# Altium project Stamp.PrjPcb
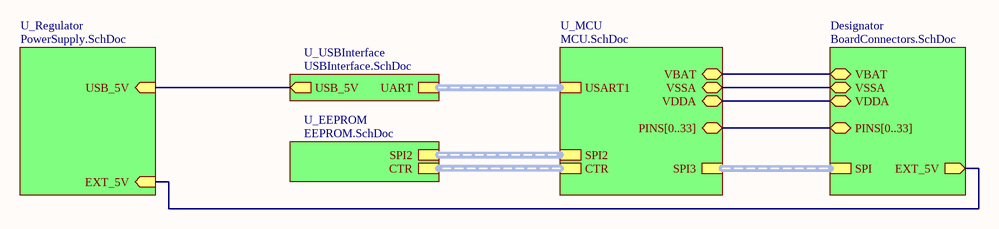
[diagram p0: Main.SchDoc]
6 sheets, 121 parts. Net scope: hierarchical (ports join the sheet entries above them; power ports are global).
Board file: Stamp.PcbDoc
Sheets:
  Main.SchDoc
    U_MCU = MCU.SchDoc
    U_USBInterface = USBInterface.SchDoc
    U_EEPROM = EEPROM.SchDoc
    U_Regulator = PowerSupply.SchDoc
    Designator = BoardConnectors.SchDoc

## Sheet Main.SchDoc
size A4; Date: 07.06.2021; Author: Mateusz Mróz; CompanyName: AGH; DocumentNumber: 1; SheetNumber: 1; SheetTotal: 6

### Sub-sheets
Designator = BoardConnectors.SchDoc: PINS[0..33] (bidir), VBAT (bidir), VDDA (bidir), VSSA (bidir), SPI (harness SPI), EXT_5V (out)
U_EEPROM = EEPROM.SchDoc: SPI2 (harness SPI), CTR (harness CTR)
U_MCU = MCU.SchDoc: CTR (harness CTR), PINS[0..33] (bidir), VDDA (bidir), VBAT (bidir), VSSA (bidir), USART1 (harness USART), SPI2 (harness SPI), SPI3 (harness SPI)
U_Regulator = PowerSupply.SchDoc: EXT_5V (in), USB_5V (in)
U_USBInterface = USBInterface.SchDoc: UART (harness UART), USB_5V (out)

### Nets
EXT_5V: sheet U_Regulator/EXT_5V, sheet Designator/EXT_5V
USB_5V: sheet U_USBInterface/USB_5V, sheet U_Regulator/USB_5V
VBAT_PIN: sheet U_MCU/VBAT, sheet Designator/VBAT
VDDA_PIN: sheet U_MCU/VDDA, sheet Designator/VDDA
VSAA_PIN: sheet U_MCU/VSSA, sheet Designator/VSSA

### Buses and harness runs
bus sheet Designator/PINS[0..33] = sheet U_MCU/PINS[0..33]
harness sheet Designator/SPI = sheet U_MCU/SPI3
harness sheet U_EEPROM/CTR = sheet U_MCU/CTR
harness sheet U_EEPROM/SPI2 = sheet U_MCU/SPI2
harness sheet U_MCU/USART1 = sheet U_USBInterface/UART

### Notes on the sheet
- University name:
- Degree course:
- 3th year electronics
- Date:
- Author:
- Student Index:
- Course:
- Checked by:
- PUE
- dr hab. inż. Cezary Worek, prof. AGH
- 305093
- Project name:
- Document name:
- Variant name:
- Sheet/all:
- /
- Version number:

## Sheet MCU.SchDoc
size A4; Date: 07.06.2021; Author: Mateusz Mróz; CompanyName: AGH; DocumentNumber: 2; SheetNumber: 2; SheetTotal: 6
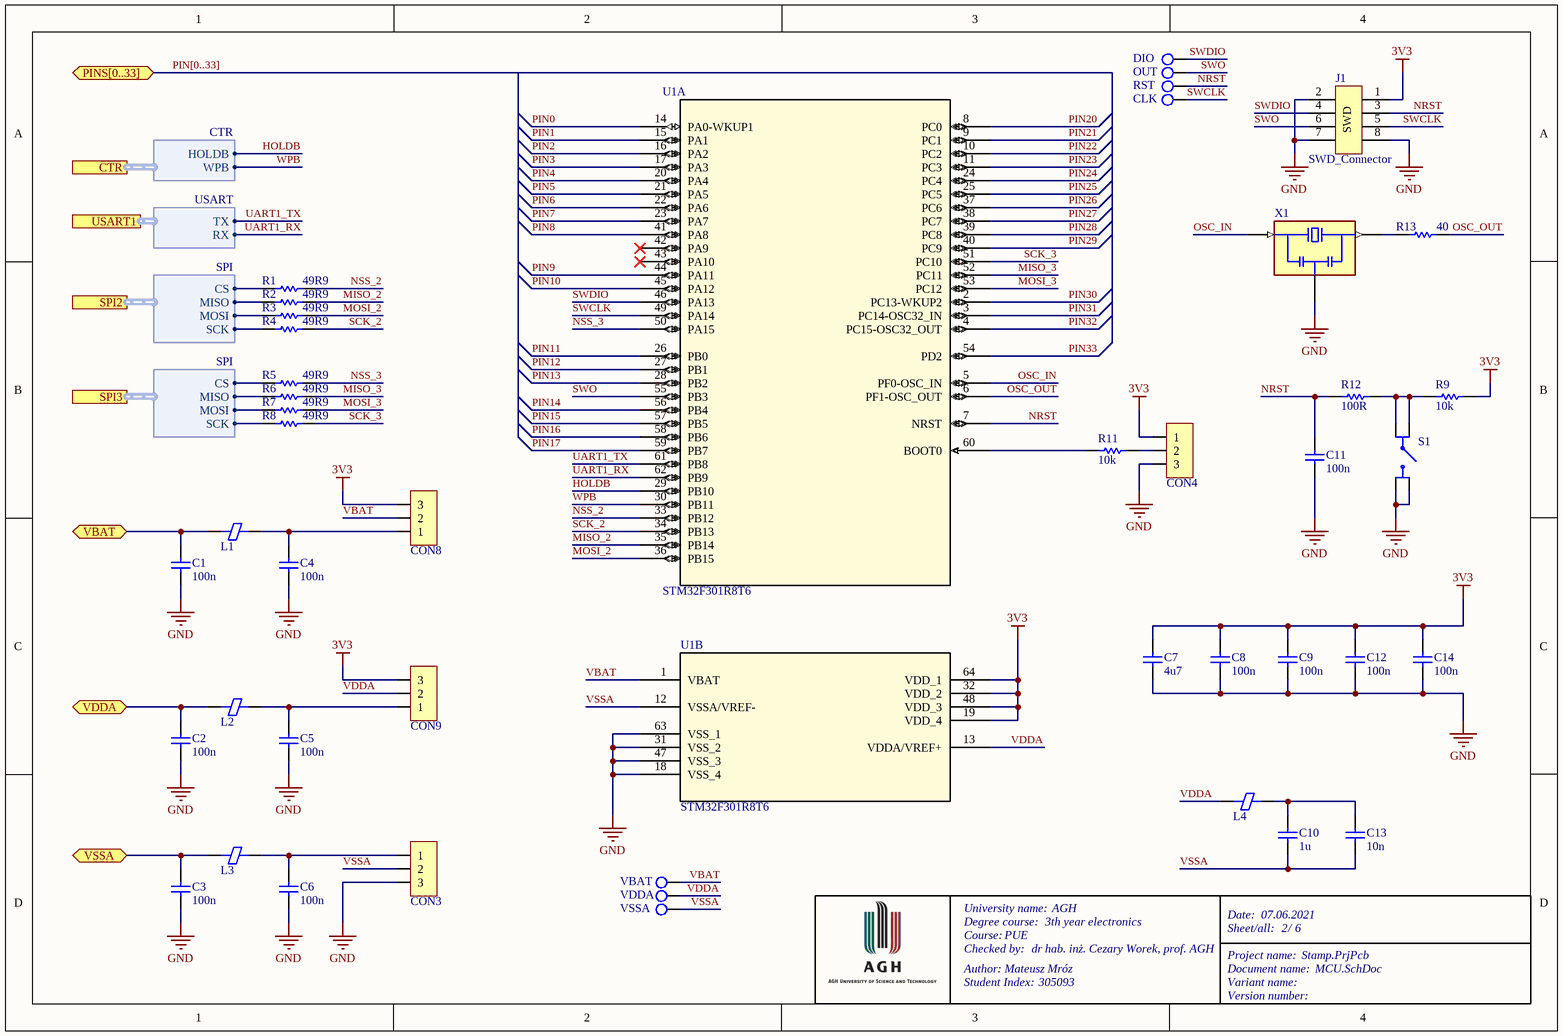
[diagram p1: MCU.SchDoc]

### Parts
C1  100n  [Cap_0402_MD_outline]
C2  100n  [Cap_0402_MD_outline]
C3  100n  [Cap_0402_MD_outline]
C4  100n  [Cap_0402_MD_outline]
C5  100n  [Cap_0402_MD_outline]
C6  100n  [Cap_0402_MD_outline]
C7  4u7  [Cap_0805_MD_outline]
C8  100n  [Cap_0603_MD_outline]
C9  100n  [Cap_0603_MD_outline]
C10  1u  [Cap_0805_MD_outline]
C11  100n  [Cap_0603_MD_outline]
C12  100n  [Cap_0603_MD_outline]
C13  10n  [Cap_0603_MD_outline]
C14  100n  [Cap_0603_MD_outline]
CON3  Header 3  [HDR_1X3_2.54]  (value not drawn)
CON4  Header 3  [HDR_1X3_2.54]  (value not drawn)
CON8  Header 3  [HDR_1X3_2.54]  (value not drawn)
CON9  Header 3  [HDR_1X3_2.54]  (value not drawn)
J1  SWD_Connector  [MicroLock_6p_vert]
L1  (no value)  [Bead_0402_MD]
L2  (no value)  [Bead_0402_MD]
L3  (no value)  [Bead_0402_MD]
L4  (no value)  [Bead_0402_MD]
R1  49R9  [Res_0603_MD_outline]
R2  49R9  [Res_0603_MD_outline]
R3  49R9  [Res_0603_MD_outline]
R4  49R9  [Res_0603_MD_outline]
R5  49R9  [Res_0603_MD]
R6  49R9  [Res_0603_MD]
R7  49R9  [Res_0603_MD]
R8  49R9  [Res_0603_MD]
R9  10k  [Res_0603_MD_outline]
R11  10k  [Res_0603_MD_outline]
R12  100R  [Res_0603_MD_outline]
R13  40  [Res_0603_MD_outline]
S1  Switch  [EVPBB0AAB000]  (value not drawn)
TP1  VBAT  [TP_SQ40]  (no BOM)
TP2  VDDA  [TP_SQ40]  (no BOM)
TP3  VSSA  [TP_SQ40]  (no BOM)
TP4  DIO  [TP_SQ25x40]  (no BOM)
TP5  OUT  [TP_SQ25x40]  (no BOM)
TP6  RST  [TP_SQ25x40]  (no BOM)
TP7  CLK  [TP_SQ25x40]  (no BOM)
U1  STM32F301R8T6  [LQFP64-10x10mm]  (parts A,B of 2)
X1  Resonator  [OSC_CSTNE8M00GH5L000R0]  (value not drawn)

### Ports
CTR (harness CTR), PINS[0..33] (bidir), SPI2 (harness SPI), SPI3 (harness SPI), USART1 (harness USART), VBAT (bidir), VDDA (bidir), VSSA (bidir)

### Harnesses
USART: TX, RX
SPI: CS, MISO, MOSI, SCK
CTR: HOLDB, WPB

### Nets
3V3: C7.2 C8.2 C9.2 C12.2 C14.2 CON4.1 CON8.3 CON9.3 J1.1 R9.2 U1.19(VDD_4) U1.32(VDD_2) U1.48(VDD_3) U1.64(VDD_1)
GND: C1.2 C2.2 C3.2 C4.2 C5.2 C6.2 C7.1 C8.1 C9.1 C11.1 C12.1 C14.1 CON3.3 CON4.3 J1.2 J1.7 J1.8 S1.A1(NO_1) S1.A2(NO_2) U1.18(VSS_4) U1.31(VSS_2) U1.47(VSS_3) U1.63(VSS_1) X1.2(GND)
CS: R1.1 ; port SPI2.CS
HOLDB: U1.29(PB10) ; port CTR.HOLDB
MISO: R2.1 ; port SPI2.MISO
MISO_2: R2.2 U1.35(PB14)
MISO_3: R6.2 U1.52(PC11)
MISO_PIN: R6.1 ; port SPI3.MISO
MOSI: R3.1 ; port SPI2.MOSI
MOSI_2: R3.2 U1.36(PB15)
MOSI_3: R7.2 U1.53(PC12)
MOSI_PIN: R7.1 ; port SPI3.MOSI
NRST: C11.2 J1.3 R12.2 TP6.1 U1.7(NRST)
NSS_2: R1.2 U1.33(PB12)
NSS_3: R5.2 U1.50(PA15)
NSS_PIN: R5.1 ; port SPI3.CS
OSC_IN: U1.5(PF0-OSC_IN) X1.1(IN)
OSC_OUT: R13.2 U1.6(PF1-OSC_OUT)
PIN0: U1.14(PA0-WKUP1)
PIN1: U1.15(PA1)
PIN2: U1.16(PA2)
PIN3: U1.17(PA3)
PIN4: U1.20(PA4)
PIN5: U1.21(PA5)
PIN6: U1.22(PA6)
PIN7: U1.23(PA7)
PIN8: U1.41(PA8)
PIN9: U1.44(PA11)
PIN10: U1.45(PA12)
PIN11: U1.26(PB0)
PIN12: U1.27(PB1)
PIN13: U1.28(PB2)
PIN14: U1.56(PB4)
PIN15: U1.57(PB5)
PIN16: U1.58(PB6)
PIN17: U1.59(PB7)
PIN20: U1.8(PC0)
PIN21: U1.9(PC1)
PIN22: U1.10(PC2)
PIN23: U1.11(PC3)
PIN24: U1.24(PC4)
PIN25: U1.25(PC5)
PIN26: U1.37(PC6)
PIN27: U1.38(PC7)
PIN28: U1.39(PC8)
PIN29: U1.40(PC9)
PIN30: U1.2(PC13-WKUP2)
PIN31: U1.3(PC14-OSC32_IN)
PIN32: U1.4(PC15-OSC32_OUT)
PIN33: U1.54(PD2)
SCK: R4.1 ; port SPI2.SCK
SCK_2: R4.2 U1.34(PB13)
SCK_3: R8.2 U1.51(PC10)
SCK_PIN: R8.1 ; port SPI3.SCK
SWCLK: J1.5 TP7.1 U1.49(PA14)
SWDIO: J1.4 TP4.1 U1.46(PA13)
SWO: J1.6 TP5.1 U1.55(PB3)
UART1_RX: U1.62(PB9) ; port USART1.RX
UART1_TX: U1.61(PB8) ; port USART1.TX
VBAT: CON8.2 TP1.1 U1.1(VBAT)
VBAT_PIN: C1.1 L1.1 ; port VBAT
VDDA: CON9.2 L4.1 TP2.1 U1.13(VDDA/VREF+)
VDDA_PIN: C2.1 L2.1 ; port VDDA
VSAA_PIN: C3.1 L3.1 ; port VSSA
VSSA: C10.1 C13.1 CON3.2 TP3.1 U1.12(VSSA/VREF-)
WPB: U1.30(PB11) ; port CTR.WPB
NetC4_1: C4.1 CON8.1 L1.2
NetC5_1: C5.1 CON9.1 L2.2
NetC6_1: C6.1 CON3.1 L3.2
NetC10_2: C10.2 C13.2 L4.2
NetCON4_2: CON4.2 R11.1
NetR9_1: R9.1 R12.1 S1.B1(COM_1) S1.B2(COM_2)
NetR11_2: R11.2 U1.60(BOOT0)
NetR13_1: R13.1 X1.3(OUT)

Not connected (* = marked no-connect by the designer): U1 42(PA9)* 43(PA10)*

### Buses and harness runs
bus PIN[0..33] = port PINS[0..33]

### Notes on the sheet
- University name:
- Degree course:
- 3th year electronics
- Date:
- Author:
- Student Index:
- Course:
- Checked by:
- PUE
- dr hab. inż. Cezary Worek, prof. AGH
- 305093
- Project name:
- Document name:
- Variant name:
- Sheet/all:
- /
- Version number:
- (in symbol SWD_Connector) SWD

### Library data of the parts
C1-C6 = Capacitor: MPN: GRM155R71H103MA88; Value: 100n; Package: 0402
C7 = Capacitor: MPN: GRM21BR71C475ME51; Value: 4u7; Package: 0805
C8 C9 C11 C12 C14 = Capacitor: MPN: GRM188R72A104KA35; Value: 100n; Package: 0603
C10 = Capacitor: MPN: GRM219R7YA105KA12; Value: 1u; Package: 0805
C13 = Capacitor: MPN: GRM188R72A103KA01; Value: 10n; Package: 0603
CON3 CON4 CON8 CON9 = Header 3: Header, 3-Pin; MPN: G800LR305018EU
J1 = SWD_Connector: Connector; MPN: 5055680671
L1-L4 = Bead: Ferrite bead; MPN: BLM15PX601SN1; Package: 0402
R1-R8 = Resistor: MPN: CRCW060349R9FKEA; Value: 49R9; Package: 0603
R9 R11 = Resistor: MPN: CRCW060310K0FKEAC; Value: 10k; Package: 0603
R12 = Resistor: MPN: CRCW0603100RFKEAHP; Value: 100R; Package: 0603
R13 = Resistor: MPN: CRCW060340R2FKEA; Value: 40; Package: 0603
S1 = EVP-BB0AAB000: MPN: EVP-BB0AAB000
TP1-TP7 = TestPoint: Test point; HelpURL: *; MPN: *
  TP1: Value: VBAT
  TP2: Value: VDDA
  TP3: Value: VSSA
  TP4: Value: DIO
  TP5: Value: OUT
  TP6: Value: RST
  TP7: Value: CLK
U1 = STM32F301R8T6: MCU LQFP64; Vendor: STMicroelectronics; Built_By: EMA_UL_Team; SourceLibrary: Updates_to_database_2020-10-19; Copyright: Copyright (C) 2018 Accelerated Designs. All rights reserved; RefDes: RefDes; Type: DEV; MPN: STM32F301R8T6
X1 = CSTNE8M00GH5L000R0_1: 8MHz Ceramic Resonator; MF: Murata Electronics; Value: 8MHz; MPN: CSTNE8M00GH5L000R0

## Sheet USBInterface.SchDoc
size A4; Date: 07.06.2021; Author: Mateusz Mróz; CompanyName: AGH; DocumentNumber: 3; SheetNumber: 3; SheetTotal: 6
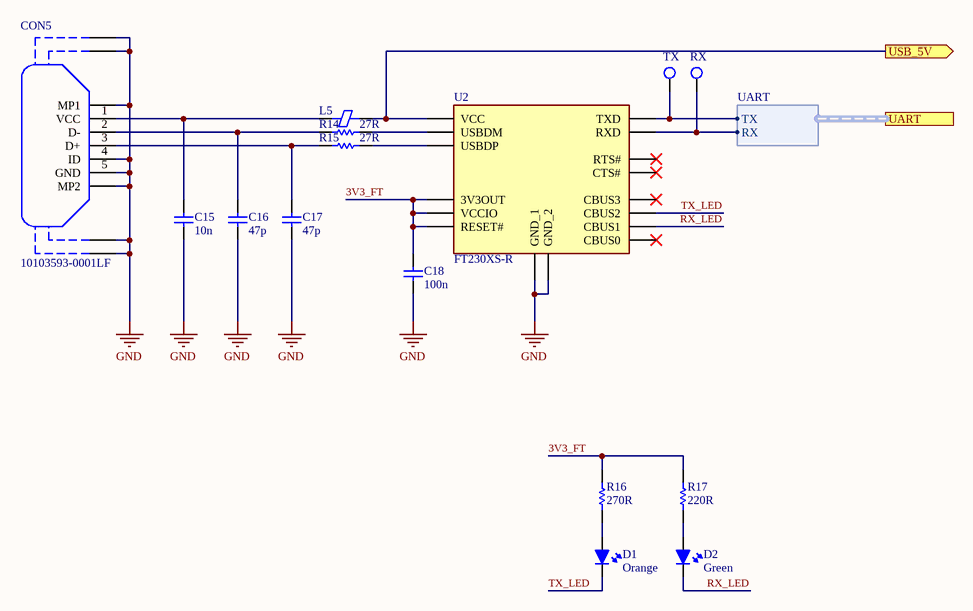
[diagram p2: USBInterface.SchDoc]

### Parts
C15  10n  [Cap_0603_MD_outline]
C16  47p  [Cap_0402_MD_outline]
C17  47p  [Cap_0402_MD_outline]
C18  100n  [Cap_0603_MD_outline]
CON5  10103593-0001LF  [101035930001LF]
D1  Orange  [LED_0805_OUTLINE]
D2  Green  [LED_0805_OUTLINE]
L5  (no value)  [Bead_0805_MD_outline]
R14  27R  [Res_0603_MD_outline]
R15  27R  [Res_0603_MD_outline]
R16  270R  [Res_0805_MD_outline]
R17  220R  [Res_0805_MD_outline]
TP8  TX  [TP_SQ25x40]  (no BOM)
TP9  RX  [TP_SQ25x40]  (no BOM)
U2  FT230XS-R  [SOP64P599X175-16N]

### Ports
UART (harness UART), USB_5V (out)

### Harnesses
UART: TX, RX

### Nets
GND: C15.1 C16.1 C17.1 C18.1 CON5.4(ID) CON5.5(GND) CON5.MH1 CON5.MH2 CON5.MH3 CON5.MH4 CON5.MP1 CON5.MP2 U2.5(GND_1) U2.13(GND_2)
3V3_FT: C18.2 R16.2 R17.2 U2.3(VCCIO) U2.10(3V3OUT) U2.11(RESET#)
RX_LED: D2.K U2.14(CBUS1)
TX_LED: D1.K U2.7(CBUS2)
UART1_RX: TP9.1 U2.4(RXD) ; port UART.RX
UART1_TX: TP8.1 U2.1(TXD) ; port UART.TX
USB_5V: L5.2 U2.12(VCC) ; port USB_5V
NetC15_2: C15.2 CON5.1(VCC) L5.1
NetC16_2: C16.2 CON5.2(D-) R14.1
NetC17_2: C17.2 CON5.3(D+) R15.1
NetD1_A: D1.A R16.1
NetD2_A: D2.A R17.1
NetR14_2: R14.2 U2.9(USBDM)
NetR15_2: R15.2 U2.8(USBDP)

Not connected (* = marked no-connect by the designer): U2 2(RTS#)* 6(CTS#)* 15(CBUS0)* 16(CBUS3)*

### Notes on the sheet
- University name:
- Degree course:
- 3th year electronics
- Date:
- Author:
- Student Index:
- Course:
- Checked by:
- PUE
- dr hab. inż. Cezary Worek, prof. AGH
- 305093
- Project name:
- Document name:
- Variant name:
- Sheet/all:
- /
- Version number:

### Library data of the parts
C15 = Capacitor: MPN: GRM188R72A103KA01; Value: 10n; Package: 0603
C16 C17 = Capacitor: MPN: VJ0402A470JXXCW1BC; Value: 47p; Package: 0402
C18 = Capacitor: MPN: GRM188R72A104KA35; Value: 100n; Package: 0603
CON5 = 10103593-0001LF: USB Connector; Manufacturer_Name: Amphenol; Datasheet Link: https://4donline.ihs.com/images/VipMasterIC/IC/FRCI/FRCIS73238/FRCIS73238-1.pdf?hkey=6D3A4C79FDBF58556ACFDE234799DDF0; Height: 3.24mm; MPN: 10103593-0001LF; Mouser Part Number: 649-10103593-0001LF; Mouser Price/Stock: https://www.mouser.co.uk/ProductDetail/Amphenol-FCI/10103593-0001LF/?qs=EnLMdcWnKAAYkpXwqGEfpw%3D%3D
D1 = LED: MPN: 599-0130-007F; Colour: Orange
D2 = LED: MPN: 599-0181-007F; Colour: Green
L5 = Bead: Ferrite bead; MPN: MPZ2012S601AT000
R14 R15 = Resistor: MPN: MCT06030C2709FP500; Value: 27R; Package: 0603
R16 = Resistor: MPN: RCS0805270RFKEA; Value: 270R; Package: 0805
R17 = Resistor: MPN: RCS0805220RFKEA; Value: 220R; Package: 0805
TP8 TP9 = TestPoint: Test point; HelpURL: *; MPN: *
  TP8: Value: TX
  TP9: Value: RX
U2 = FT230XS-R: USB converter; Manufacturer_Name: FTDI Chip; Datasheet Link: http://www.ftdichip.com/Support/Documents/DataSheets/ICs/DS_FT230X.pdf; Height: 1.753mm; MPN: FT230XS-R; Mouser Part Number: 895-FT230XS-R; Mouser Price/Stock: https://www.mouser.co.uk/ProductDetail/FTDI/FT230XS-R?qs=Gp1Yz1mis3XyCLeYOseSng%3D%3D; Arrow Part Number: FT230XS-R; Arrow Price/Stock: http://www.arrow.com/en/products/ft230xs-r/ftdi-chip

## Sheet EEPROM.SchDoc
size A4; Date: 07.06.2021; Author: Mateusz Mróz; CompanyName: AGH; DocumentNumber: 4; SheetNumber: 4; SheetTotal: 6
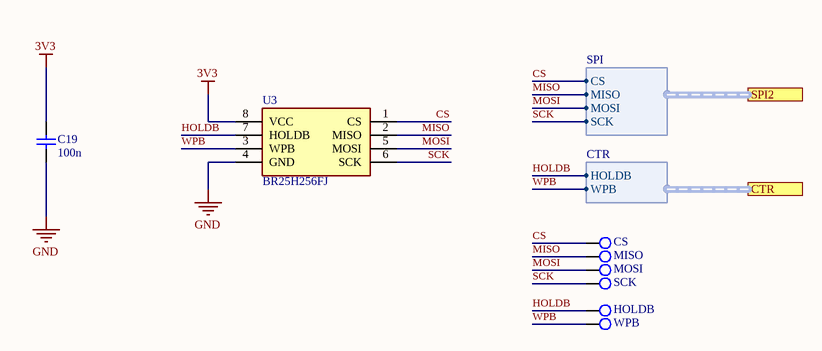
[diagram p3: EEPROM.SchDoc]

### Parts
C19  100n  [Cap_0603_MD_outline]
TP10  CS  [TP_SQ25x40]  (no BOM)
TP11  MISO  [TP_SQ25x40]  (no BOM)
TP12  MOSI  [TP_SQ25x40]  (no BOM)
TP13  SCK  [TP_SQ25x40]  (no BOM)
TP14  HOLDB  [TP_SQ25x40]  (no BOM)
TP15  WPB  [TP_SQ25x40]  (no BOM)
U3  BR25H256FJ  [SOIC127P600X165-8N]

### Ports
CTR (harness CTR), SPI2 (harness SPI)

### Harnesses
SPI: CS, MISO, MOSI, SCK
CTR: HOLDB, WPB

### Nets
3V3: C19.2 U3.8(VCC)
GND: C19.1 U3.4(GND)
CS: TP10.1 U3.1(CS) ; port SPI2.CS
HOLDB: TP14.1 U3.7(HOLDB) ; port CTR.HOLDB
MISO: TP11.1 U3.2(MISO) ; port SPI2.MISO
MOSI: TP12.1 U3.5(MOSI) ; port SPI2.MOSI
SCK: TP13.1 U3.6(SCK) ; port SPI2.SCK
WPB: TP15.1 U3.3(WPB) ; port CTR.WPB

### Notes on the sheet
- University name:
- Degree course:
- 3th year electronics
- Date:
- Author:
- Student Index:
- Course:
- Checked by:
- PUE
- dr hab. inż. Cezary Worek, prof. AGH
- 305093
- Project name:
- Document name:
- Variant name:
- Sheet/all:
- /
- Version number:

### Library data of the parts
C19 = Capacitor: MPN: GRM188R72A104KA35; Value: 100n; Package: 0603
TP10-TP15 = TestPoint: Test point; HelpURL: *; MPN: *
  TP10: Value: CS
  TP11: Value: MISO
  TP12: Value: MOSI
  TP13: Value: SCK
  TP14: Value: HOLDB
  TP15: Value: WPB
U3 = BR25H256FJ: EEPROM; Manufacturer_Name: ROHM Semiconductor; MPN: BR25H256FJ-2ACE2; Datasheet Link: https://ms.componentsearchengine.com/Datasheets/1/BR25H256FJ-2ACE2.pdf; Height: 1.65mm; Mouser Part Number: 755-BR25H256FJ-2ACE2; Mouser Price/Stock: https://www.mouser.co.uk/ProductDetail/ROHM-Semiconductor/BR25H256FJ-2ACE2?qs=zGux8KhMp6KpbA8DPfpjPg%3D%3D

## Sheet PowerSupply.SchDoc
size A4; Date: 07.06.2021; Author: Mateusz Mróz; CompanyName: AGH; DocumentNumber: 5; SheetNumber: 5; SheetTotal: 6
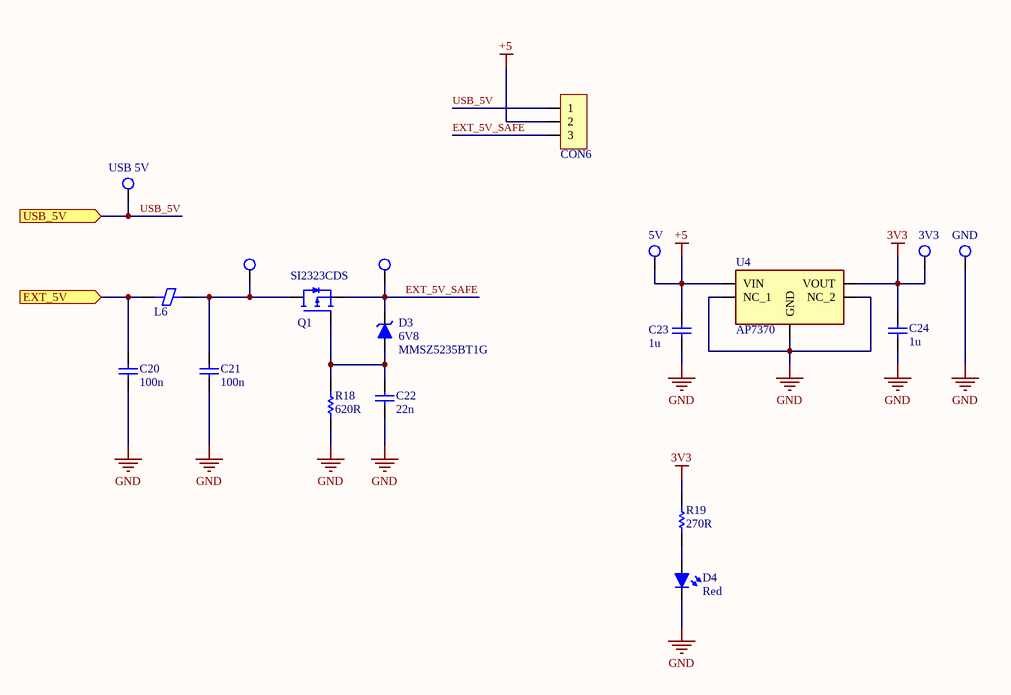
[diagram p4: PowerSupply.SchDoc]

### Parts
C20  100n  [Cap_0402_MD_outline]
C21  100n  [Cap_0402_MD_outline]
C22  22n  [Cap_0603_MD_outline]
C23  1u  [Cap_0805_MD_outline]
C24  1u  [Cap_0805_MD_outline]
CON6  Header 3  [HDR_1X3_2.54]  (value not drawn)
D3  MMSZ5235BT1G  Zener volatge: 6V8  [SOD3716X135N]
D4  Red  [LED_0805_OUTLINE]
L6  (no value)  [Bead_0402_MD_Outline]
Q1  SI2323CDS  [SOT95P237X112-3N]
R18  620R  [Res_0603_MD_outline]
R19  270R  [Res_0805_MD_outline]
TP16  USB 5V  [TP_SQ40]  (no BOM)
TP17  *  [TP_SQ40]  (value not drawn)  (no BOM)
TP18  *  [TP_SQ40]  (value not drawn)  (no BOM)
TP19  5V  [TP_SQ40]  (no BOM)
TP20  3V3  [TP_SQ40]  (no BOM)
TP21  GND  [TP_SQ40]  (no BOM)
U4  AP7370  [SOT95P285X140-5N]

### Ports
EXT_5V (in), USB_5V (in)

### Nets
3V3: C24.2 R19.2 TP20.1 U4.3(VOUT)
+5: C23.2 CON6.2 TP19.1 U4.1(VIN)
GND: C20.2 C21.1 C22.1 C23.1 C24.1 D4.K R18.1 TP21.1 U4.2(GND) U4.4(NC_1) U4.5(NC_2)
EXT_5V: C20.1 L6.1 ; port EXT_5V
EXT_5V_SAFE: CON6.3 D3.1(K) Q1.2(S) TP18.1
USB_5V: CON6.1 TP16.1 ; port USB_5V
NetC21_2: C21.2 L6.2 Q1.3(D) TP17.1
NetC22_2: C22.2 D3.2(A) Q1.1(G) R18.2
NetD4_A: D4.A R19.1

### Notes on the sheet
- University name:
- Degree course:
- 3th year electronics
- Date:
- Author:
- Student Index:
- Course:
- Checked by:
- PUE
- dr hab. inż. Cezary Worek, prof. AGH
- 305093
- Project name:
- Document name:
- Variant name:
- Sheet/all:
- /
- Version number:

### Library data of the parts
C20 C21 = Capacitor: MPN: GRM155R71H103MA88; Value: 100n; Package: 0402
C22 = Capacitor: MPN: GRM188R72A223KAC4D; Value: 22n; Package: 0603
C23 C24 = Capacitor: MPN: GRM219R7YA105KA12; Value: 1u; Package: 0805
CON6 = Header 3: Header, 3-Pin; MPN: G800LR305018EU
D3 = MMSZ5240BT1G: Zener Diode; MPN: MMSZ5235BT1G
D4 = LED: MPN: 599-0110-007F; Colour: Red
L6 = Bead: Ferrite bead; MPN: BLM15PX601SN1; Package: 0402
Q1 = SI2323CDS: P-MOSFET; MPN: SI2323CDS-T1-GE3
R18 = Resistor: MPN: CRCW0603620RFKEAC; Value: 620R; Package: 0603
R19 = Resistor: MPN: RCS0805270RFKEA; Value: 270R; Package: 0805
TP16-TP21 = TestPoint: Test point; HelpURL: *; MPN: *
  TP16: Value: USB 5V
  TP17 TP18: Value: *
  TP19: Value: 5V
  TP20: Value: 3V3
  TP21: Value: GND
U4 = AP7370-33WW-7: Volatge Regulator 3V3; Manufacturer_Name: Diodes Inc.; Datasheet Link: https://componentsearchengine.com/Datasheets/1/AP7370-33WW-7.pdf; Height: 1.4mm; Mouser Part Number: 621-AP7370-33WW-7; Mouser Price/Stock: https://www.mouser.co.uk/ProductDetail/Diodes-Incorporated/AP7370-33WW-7?qs=%252B6g0mu59x7LthBU4%252B8t%252BZQ%3D%3D; Arrow Part Number: AP7370-33WW-7; Arrow Price/Stock: https://www.arrow.com/en/products/ap7370-33ww-7/diodes-incorporated; MPN: AP7370-33WW-7

## Sheet BoardConnectors.SchDoc
size A4; Date: 07.06.2021; Author: Mateusz Mróz; CompanyName: AGH; DocumentNumber: 6; SheetNumber: 6; SheetTotal: 6
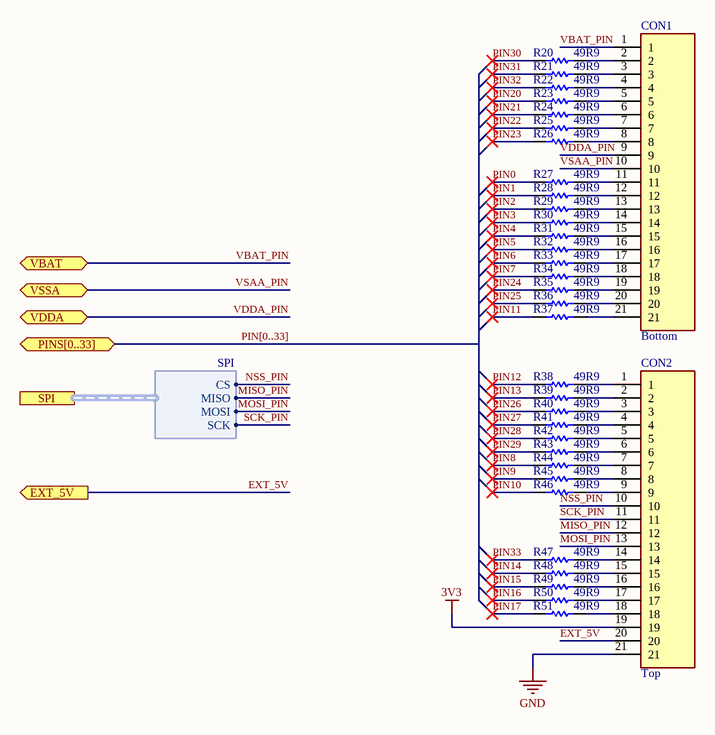
[diagram p5: BoardConnectors.SchDoc]

### Parts
CON1  Location: Bottom  [HDR_1X21_2.54]  (hidden comment: Header 21)
CON2  Location: Top  [HDR_1X21_2.54]  (hidden comment: Header 21)
R20  49R9  [Res_0603_MD]
R21  49R9  [Res_0603_MD]
R22  49R9  [Res_0603_MD]
R23  49R9  [Res_0603_MD]
R24  49R9  [Res_0603_MD]
R25  49R9  [Res_0603_MD]
R26  49R9  [Res_0603_MD]
R27  49R9  [Res_0603_MD]
R28  49R9  [Res_0603_MD]
R29  49R9  [Res_0603_MD]
R30  49R9  [Res_0603_MD]
R31  49R9  [Res_0603_MD]
R32  49R9  [Res_0603_MD]
R33  49R9  [Res_0603_MD]
R34  49R9  [Res_0603_MD]
R35  49R9  [Res_0603_MD]
R36  49R9  [Res_0603_MD]
R37  49R9  [Res_0603_MD]
R38  49R9  [Res_0603_MD]
R39  49R9  [Res_0603_MD]
R40  49R9  [Res_0603_MD]
R41  49R9  [Res_0603_MD]
R42  49R9  [Res_0603_MD]
R43  49R9  [Res_0603_MD]
R44  49R9  [Res_0603_MD]
R45  49R9  [Res_0603_MD]
R46  49R9  [Res_0603_MD]
R47  49R9  [Res_0603_MD]
R48  49R9  [Res_0603_MD]
R49  49R9  [Res_0603_MD]
R50  49R9  [Res_0603_MD]
R51  49R9  [Res_0603_MD]

### Ports
EXT_5V (out), PINS[0..33] (bidir), SPI (harness SPI), VBAT (bidir), VDDA (bidir), VSSA (bidir)

### Harnesses
SPI: CS, MISO, MOSI, SCK

### Nets
3V3: CON2.19
GND: CON2.21
EXT_5V: CON2.20 ; port EXT_5V
MISO_PIN: CON2.12 ; port SPI.MISO
MOSI_PIN: CON2.13 ; port SPI.MOSI
NSS_PIN: CON2.10 ; port SPI.CS
PIN0: R27.1
PIN1: R28.1
PIN2: R29.1
PIN3: R30.1
PIN4: R31.1
PIN5: R32.1
PIN6: R33.1
PIN7: R34.1
PIN8: R44.1
PIN9: R45.1
PIN10: R46.1
PIN11: R37.1
PIN12: R38.1
PIN13: R39.1
PIN14: R48.1
PIN15: R49.1
PIN16: R50.1
PIN17: R51.1
PIN20: R23.1
PIN21: R24.1
PIN22: R25.1
PIN23: R26.1
PIN24: R35.1
PIN25: R36.1
PIN26: R40.1
PIN27: R41.1
PIN28: R42.1
PIN29: R43.1
PIN30: R20.1
PIN31: R21.1
PIN32: R22.1
PIN33: R47.1
SCK_PIN: CON2.11 ; port SPI.SCK
VBAT_PIN: CON1.1 ; port VBAT
VDDA_PIN: CON1.9 ; port VDDA
VSAA_PIN: CON1.10 ; port VSSA
NetCON1_2: CON1.2 R20.2
NetCON1_3: CON1.3 R21.2
NetCON1_4: CON1.4 R22.2
NetCON1_5: CON1.5 R23.2
NetCON1_6: CON1.6 R24.2
NetCON1_7: CON1.7 R25.2
NetCON1_8: CON1.8 R26.2
NetCON1_11: CON1.11 R27.2
NetCON1_12: CON1.12 R28.2
NetCON1_13: CON1.13 R29.2
NetCON1_14: CON1.14 R30.2
NetCON1_15: CON1.15 R31.2
NetCON1_16: CON1.16 R32.2
NetCON1_17: CON1.17 R33.2
NetCON1_18: CON1.18 R34.2
NetCON1_19: CON1.19 R35.2
NetCON1_20: CON1.20 R36.2
NetCON1_21: CON1.21 R37.2
NetCON2_1: CON2.1 R38.2
NetCON2_2: CON2.2 R39.2
NetCON2_3: CON2.3 R40.2
NetCON2_4: CON2.4 R41.2
NetCON2_5: CON2.5 R42.2
NetCON2_6: CON2.6 R43.2
NetCON2_7: CON2.7 R44.2
NetCON2_8: CON2.8 R45.2
NetCON2_9: CON2.9 R46.2
NetCON2_14: CON2.14 R47.2
NetCON2_15: CON2.15 R48.2
NetCON2_16: CON2.16 R49.2
NetCON2_17: CON2.17 R50.2
NetCON2_18: CON2.18 R51.2

### Buses and harness runs
bus PIN[0..33] = port PINS[0..33]

### Notes on the sheet
- University name:
- Degree course:
- 3th year electronics
- Date:
- Author:
- Student Index:
- Course:
- Checked by:
- PUE
- dr hab. inż. Cezary Worek, prof. AGH
- 305093
- Project name:
- Document name:
- Variant name:
- Sheet/all:
- /
- Version number:

### Library data of the parts
CON1 CON2 = Header 21: Connector; Manufacturer_Name: Amphenol; MPN: 68001-121HLF; Datasheet Link: http://docs-emea.rs-online.com/webdocs/1450/0900766b81450c45.pdf; Height: 8.58mm; Mouser Part Number: 649-68001-121HLF; Mouser Price/Stock: https://www.mouser.co.uk/ProductDetail/Amphenol-FCI/68001-121HLF/?qs=QKvFUfBIyQK%252BoxmWjqVzjQ%3D%3D; Arrow Part Number: 68001-121HLF; Arrow Price/Stock: https://www.arrow.com/en/products/68001-121hlf/amphenol-fci; System: Connector
R20-R51 = Resistor: MPN: CRCW060349R9FKEA; Value: 49R9; Package: 0603

## Nets that join several sheets
3V3: MCU (14 pins), EEPROM (C19.2 U3.8), PowerSupply (C24.2 R19.2 TP20.1 U4.3), BoardConnectors (CON2.19)
GND: MCU (24 pins), USBInterface (14 pins), EEPROM (C19.1 U3.4), PowerSupply (11 pins), BoardConnectors (CON2.21)
CS: MCU (R1.1), EEPROM (TP10.1 U3.1)
EXT_5V: PowerSupply (C20.1 L6.1), BoardConnectors (CON2.20)
HOLDB: MCU (U1.29), EEPROM (TP14.1 U3.7)
MISO: MCU (R2.1), EEPROM (TP11.1 U3.2)
MISO_PIN: MCU (R6.1), BoardConnectors (CON2.12)
MOSI: MCU (R3.1), EEPROM (TP12.1 U3.5)
MOSI_PIN: MCU (R7.1), BoardConnectors (CON2.13)
NSS_PIN: MCU (R5.1), BoardConnectors (CON2.10)
PIN0: MCU (U1.14), BoardConnectors (R27.1)
PIN1: MCU (U1.15), BoardConnectors (R28.1)
PIN2: MCU (U1.16), BoardConnectors (R29.1)
PIN3: MCU (U1.17), BoardConnectors (R30.1)
PIN4: MCU (U1.20), BoardConnectors (R31.1)
PIN5: MCU (U1.21), BoardConnectors (R32.1)
PIN6: MCU (U1.22), BoardConnectors (R33.1)
PIN7: MCU (U1.23), BoardConnectors (R34.1)
PIN8: MCU (U1.41), BoardConnectors (R44.1)
PIN9: MCU (U1.44), BoardConnectors (R45.1)
PIN10: MCU (U1.45), BoardConnectors (R46.1)
PIN11: MCU (U1.26), BoardConnectors (R37.1)
PIN12: MCU (U1.27), BoardConnectors (R38.1)
PIN13: MCU (U1.28), BoardConnectors (R39.1)
PIN14: MCU (U1.56), BoardConnectors (R48.1)
PIN15: MCU (U1.57), BoardConnectors (R49.1)
PIN16: MCU (U1.58), BoardConnectors (R50.1)
PIN17: MCU (U1.59), BoardConnectors (R51.1)
PIN20: MCU (U1.8), BoardConnectors (R23.1)
PIN21: MCU (U1.9), BoardConnectors (R24.1)
PIN22: MCU (U1.10), BoardConnectors (R25.1)
PIN23: MCU (U1.11), BoardConnectors (R26.1)
PIN24: MCU (U1.24), BoardConnectors (R35.1)
PIN25: MCU (U1.25), BoardConnectors (R36.1)
PIN26: MCU (U1.37), BoardConnectors (R40.1)
PIN27: MCU (U1.38), BoardConnectors (R41.1)
PIN28: MCU (U1.39), BoardConnectors (R42.1)
PIN29: MCU (U1.40), BoardConnectors (R43.1)
PIN30: MCU (U1.2), BoardConnectors (R20.1)
PIN31: MCU (U1.3), BoardConnectors (R21.1)
PIN32: MCU (U1.4), BoardConnectors (R22.1)
PIN33: MCU (U1.54), BoardConnectors (R47.1)
SCK: MCU (R4.1), EEPROM (TP13.1 U3.6)
SCK_PIN: MCU (R8.1), BoardConnectors (CON2.11)
UART1_RX: MCU (U1.62), USBInterface (TP9.1 U2.4)
UART1_TX: MCU (U1.61), USBInterface (TP8.1 U2.1)
USB_5V: USBInterface (L5.2 U2.12), PowerSupply (CON6.1 TP16.1)
VBAT_PIN: MCU (C1.1 L1.1), BoardConnectors (CON1.1)
VDDA_PIN: MCU (C2.1 L2.1), BoardConnectors (CON1.9)
VSAA_PIN: MCU (C3.1 L3.1), BoardConnectors (CON1.10)
WPB: MCU (U1.30), EEPROM (TP15.1 U3.3)